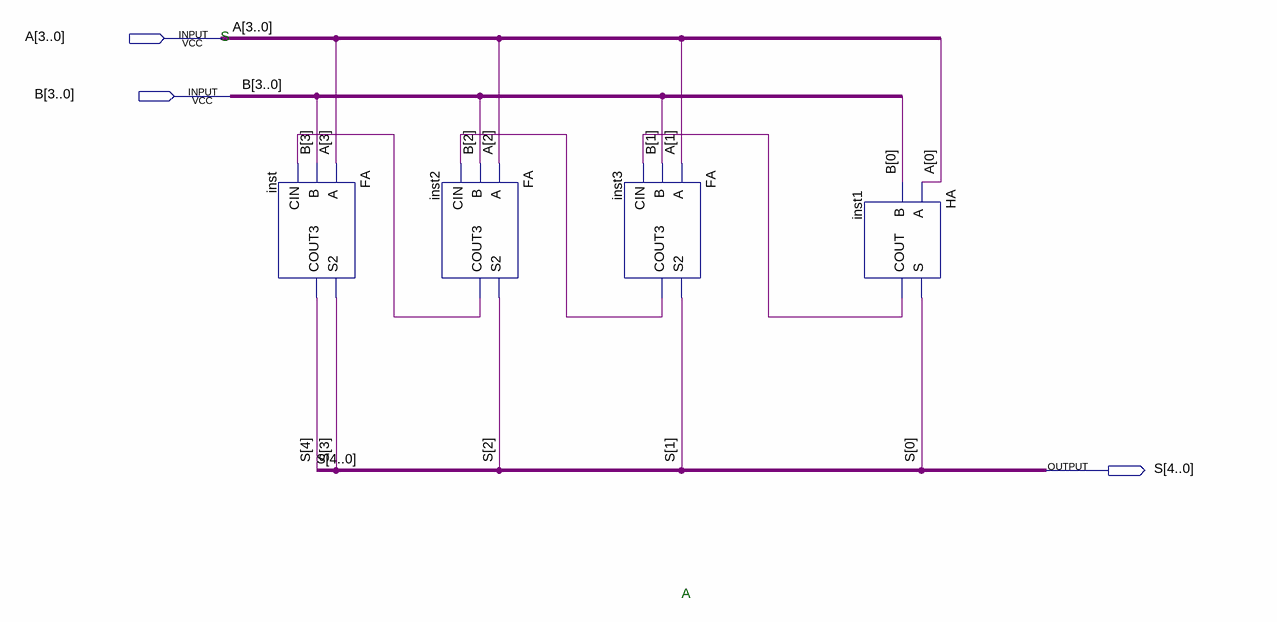
[diagram p0: schematic sheet]
// Quartus schematic CONG4BIT.bdf as structural Verilog: 4 symbols, 3 pins
module CONG4BIT (
  input  [3:0] A,
  input  [3:0] B,
  output [4:0] S
);

  wire inst1_cout, inst2_cout3, inst3_cout3;

  FA inst (.A(A[3]), .B(B[3]), .CIN(inst2_cout3), .S2(S[3]), .COUT3(S[4]));
  FA inst2 (.A(A[2]), .B(B[2]), .CIN(inst3_cout3), .S2(S[2]), .COUT3(inst2_cout3));
  FA inst3 (.A(A[1]), .B(B[1]), .CIN(inst1_cout), .S2(S[1]), .COUT3(inst3_cout3));
  HA inst1 (.A(A[0]), .B(B[0]), .S(S[0]), .COUT(inst1_cout));

  // Notes on the sheet:
  //   S
  //   A
endmodule
